# Altium schematic sheet 01 COVER PAGE.SchDoc: COVER PAGE
size 420 x 297 mm; SheetNumber: 1; SheetTotal: 10
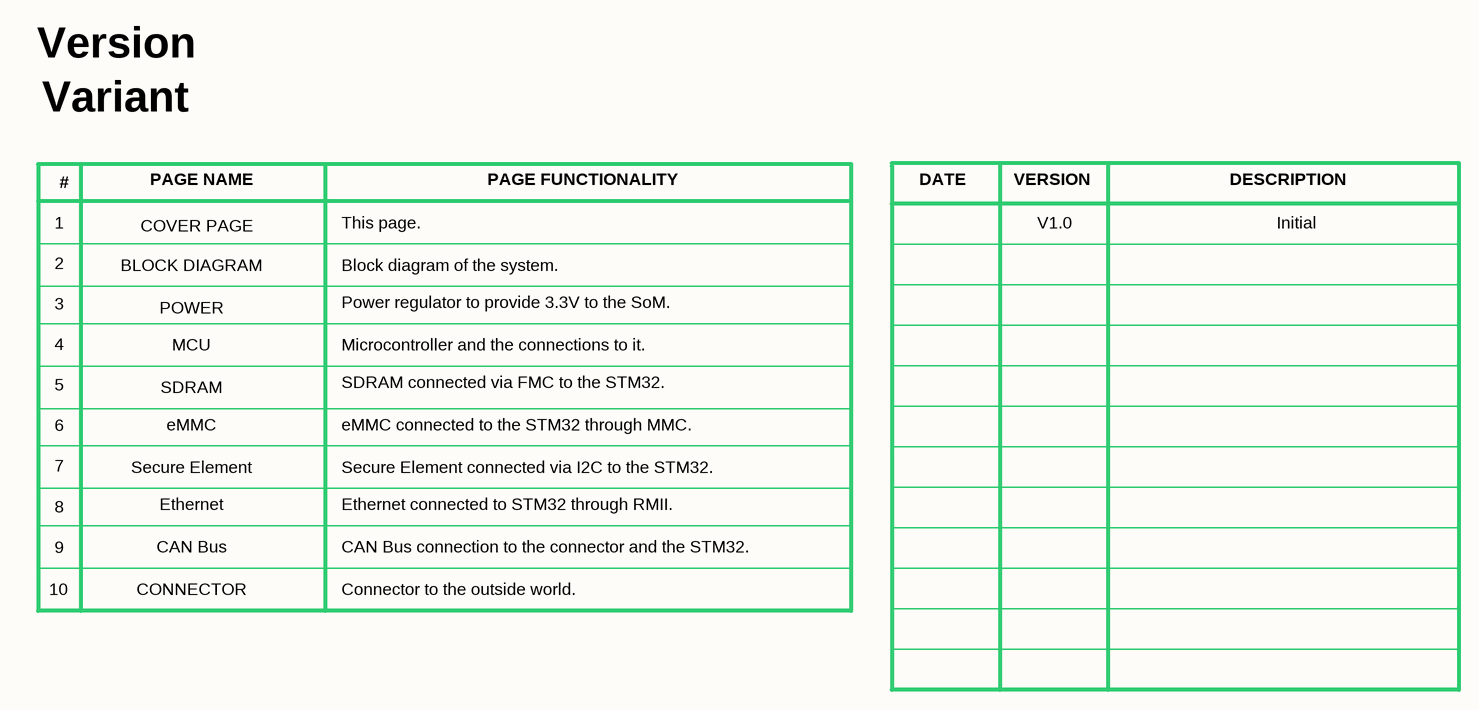
[diagram p0: 01 COVER PAGE.SchDoc]

## Notes on the sheet
- Version
- Variant
- 1
- #
- PAGE NAME
- COVER PAGE
- This page.
- PAGE FUNCTIONALITY
- DATE
- VERSION
- V1.0
- DESCRIPTION
- Initial
- 2
- BLOCK DIAGRAM
- POWER
- Block diagram of the system.
- Power regulator to provide 3.3V to the SoM.
- 3
- 4
- MCU
- Microcontroller and the connections to it.
- 5
- 6
- SDRAM
- eMMC
- SDRAM connected via FMC to the STM32.
- eMMC connected to the STM32 through MMC.
- 7
- Secure Element
- Ethernet
- Secure Element connected via I2C to the STM32.
- Ethernet connected to STM32 through RMII.
- 8
- 9
- CAN Bus
- CAN Bus connection to the connector and the STM32.
- 10
- CONNECTOR
- Connector to the outside world.
- Title
- Project
- Size
- Date
- Revision
- A3
- Designed By